# Altium schematic sheet DSO_Control.SchDoc: DSO
size A4; CompanyName: University of Melbourne; Engineer: Huawang Liu; Organization: University of Melbourne; DocumentNumber: 1; Revision: 1.0; SheetNumber: 9; SheetTotal: 11; Title_Project: DSO; StudentNo: 855983; ProjectName: DSO
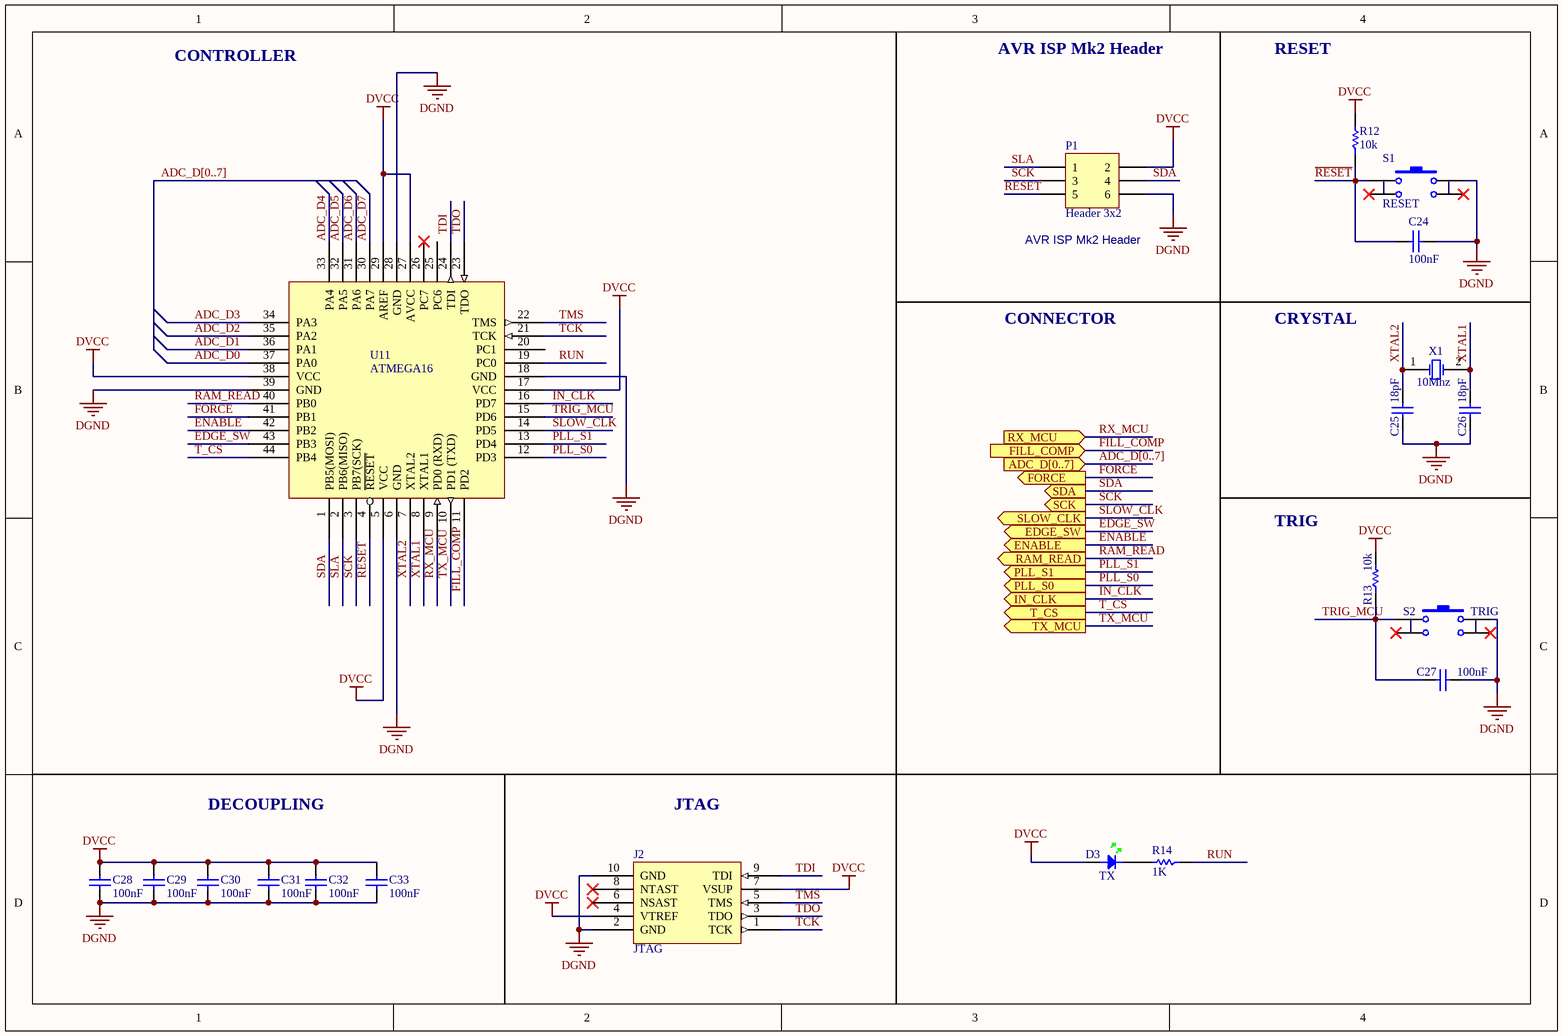
[diagram p0: DSO_Control.SchDoc]

## Parts
C24  100nF  [0805C]
C25  18pF  [0805C]
C26  18pF  [0805C]
C27  100nF  [0805C]
C28  100nF  [0805C]
C29  100nF  [0805C]
C30  100nF  [0805C]
C31  100nF  [0805C]
C32  100nF  [0805C]
C33  100nF  [0805C]
D3  TX  [0805D-GREEN]
J2  JTAG  [BOXEDVERT10]
P1  Header 3x2  [HDR3x2]
R12  10k  [0805]
R13  10k  [0805]
R14  1K  [0805]
S1  RESET  [SPST PB SWITCH SMD]
S2  TRIG  [SPST PB SWITCH SMD]
U11  ATMEGA16  [QFP-48]
X1  10Mhz  [XTAL_FLAT_SMD]

## Ports
ADC_D[0..7] (in), EDGE_SW (out), ENABLE (out), FILL_COMP (in), FORCE (out), IN_CLK (out), PLL_S0 (out), PLL_S1 (out), RAM_READ (out), RX_MCU (in), SCK (out), SDA (out), SLOW_CLK (out), T_CS (out), TX_MCU (out)

## Nets
DGND: C24.1 C25.2 C26.2 C27.1 C28.2 C29.2 C30.2 C31.2 C32.2 C33.2 J2.2(GND) J2.10(GND) P1.6 S1.2 S2.2 U11.6(GND) U11.18(GND) U11.28(GND) U11.39(GND)
DVCC: C28.1 C29.1 C30.1 C31.1 C32.1 C33.1 D3.A J2.4(VTREF) J2.7(VSUP) P1.2 R12.2 R13.2 U11.5(VCC) U11.17(VCC) U11.27(AVCC) U11.29(AREF) U11.38(VCC)
ADC_D0: U11.37(PA0)
ADC_D1: U11.36(PA1)
ADC_D2: U11.35(PA2)
ADC_D3: U11.34(PA3)
ADC_D4: U11.33(PA4)
ADC_D5: U11.32(PA5)
ADC_D6: U11.31(PA6)
ADC_D7: U11.30(PA7)
EDGE_SW: U11.43(PB3) ; port EDGE_SW
ENABLE: U11.42(PB2) ; port ENABLE
FILL_COMP: U11.11(PD2) ; port FILL_COMP
FORCE: U11.41(PB1) ; port FORCE
IN_CLK: U11.16(PD7) ; port IN_CLK
PLL_S0: U11.12(PD3) ; port PLL_S0
PLL_S1: U11.13(PD4) ; port PLL_S1
~{RESET}: C24.2 P1.5 R12.1 S1.1 U11.4(~{RESET})
RAM_READ: U11.40(PB0) ; port RAM_READ
RUN: R14.1 U11.19(PC0)
RX_MCU: U11.9(PD0_(RXD)) ; port RX_MCU
SCK: P1.3 U11.3(PB7(SCK)) ; port SCK
SDA: P1.4 U11.1(PB5(MOSI)) ; port SDA
SLA: P1.1 U11.2(PB6(MISO))
SLOW_CLK: U11.14(PD5) ; port SLOW_CLK
T_CS: U11.44(PB4) ; port T_CS
TCK: J2.1(TCK) U11.21(TCK)
TDI: J2.9(TDI) U11.24(TDI)
TDO: J2.3(TDO) U11.23(TDO)
TMS: J2.5(TMS) U11.22(TMS)
TRIG_MCU: C27.2 R13.1 S2.1 U11.15(PD6)
TX_MCU: U11.10(PD1_(TXD)) ; port TX_MCU
XTAL1: C26.1 U11.8(XTAL1) X1.2(OSC2)
XTAL2: C25.1 U11.7(XTAL2) X1.1(OSC1)
NetD3_K: D3.K R14.2

Not connected (* = marked no-connect by the designer): J2 6(NSAST)* 8(NTAST)*; S1 3* 4*; S2 3* 4*; U11 20(PC1) 25(PC6) 26(PC7)*

## Buses and harness runs
bus ADC_D[0..7]
bus ADC_D[0..7] = port ADC_D[0..7]

## Notes on the sheet
- CONTROLLER
- AVR ISP Mk2 Header
- RESET
- (near P1) AVR ISP Mk2 Header
- CONNECTOR
- CRYSTAL
- TRIG
- DECOUPLING
- JTAG

## Library data of the parts
C24-C33 = C: Capacitor; Reviewed by: RM - 2018/08/05; Revision: July-2002: Re-released for DXP Platform.; Supplier 1: *; Supplier Part Number 1: *
  C24 C27-C33: Value: 100nF
  C25 C26: Value: 18pF
D3 = LED GREEN: Light Emitting Diode; Reviewed by: RM - 2018/08/05; Revision: July-2002: Re-released for DXP Platform.; Supplier 1: Digi-Key; Supplier Part Number 1: 160-1423-1-ND
J2 = JTAG_CON: Reviewed by: RM - 2018/08/05; Supplier 1: Digi-Key; Supplier Part Number 1: OR896-ND
P1 = Header 3x2: Header, 5-Pin; Reviewed by: RM - 2018/08/05; Supplier 1: Digi-Key; Supplier Part Number 1: 952-2121-ND
R12 R13 = R: Resistor; Reviewed by: RM - 2018/08/05; Value: 10k; Supplier 1: *; Suppler Part Number 1: *
R14 = R: Resistor; Value: 1K
S1 S2 = SW_PB_1P1T4: Momentary Push Button Switch 1P 1T 2pins; Reviewed by: RM - 2018/08/05; Revision: July-2002: Re-released for DXP Platform.; Supplier 1: Digi-Key; Supplier Part Number 1: CKN9085CT-ND
U11 = ATMEGA16: ATMEGA16 Microcontroller; Reviewed by: RM - 2018/08/05; Supplier 1: Digi-Key; Supplier Part Number 1: ATMEGA16A-AU-ND
X1 = XTAL: Crystal Oscillator; Reviewed by: RM - 2018/08/05; Revision: July-2002: Re-released for DXP Platform.; Supplier 1: Digi-Key; Supplier Part Number 1: 887-1080-1-ND